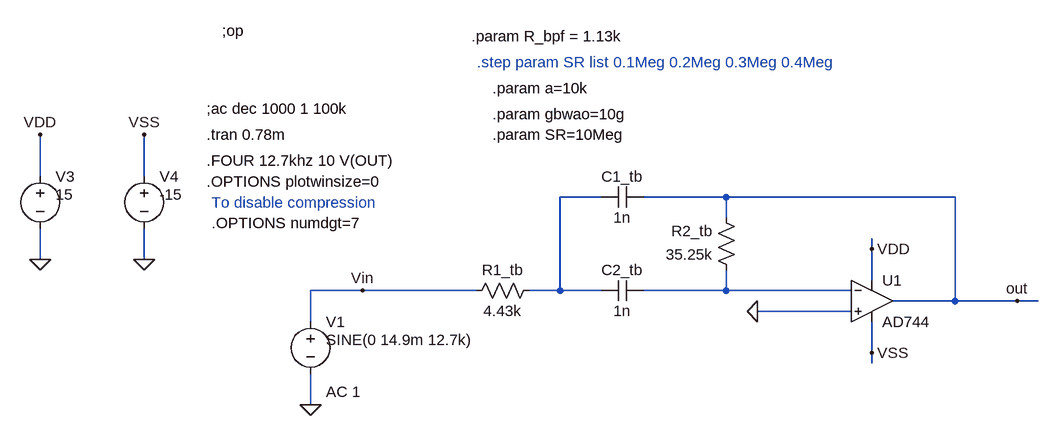
[diagram p0: schematic FTB_Rauch[1].asc]
FTB_Rauch[1].asc, the LTspice schematic file:
Version 4
SHEET 1 2932 1708
WIRE 1088 -16 1088 -80
WIRE 1248 -16 1248 -80
WIRE 1952 16 1888 16
WIRE 2144 16 2016 16
WIRE 2496 16 2144 16
WIRE 2144 48 2144 16
WIRE 2368 96 2368 80
WIRE 1088 112 1088 64
WIRE 1248 112 1248 64
WIRE 2368 144 2368 96
WIRE 1584 160 1504 160
WIRE 1760 160 1584 160
WIRE 1888 160 1888 16
WIRE 1888 160 1840 160
WIRE 1952 160 1888 160
WIRE 2144 160 2144 128
WIRE 2144 160 2016 160
WIRE 2336 160 2144 160
WIRE 2496 176 2496 16
WIRE 2496 176 2400 176
WIRE 2592 176 2496 176
WIRE 2624 176 2592 176
WIRE 2336 192 2192 192
WIRE 1504 208 1504 160
WIRE 2368 256 2368 208
WIRE 2368 272 2368 256
WIRE 1504 336 1504 288
FLAG 1088 112 0
FLAG 1248 112 0
FLAG 1088 -80 VDD
FLAG 1248 -80 VSS
FLAG 1504 336 0
FLAG 2592 176 out
FLAG 2368 256 VSS
FLAG 2368 96 VDD
FLAG 1584 160 Vin
FLAG 2192 192 0
DATAFLAG 1664 160 ""
DATAFLAG 1920 160 ""
DATAFLAG 2192 160 ""
DATAFLAG 2272 192 ""
DATAFLAG 2464 176 ""
SYMBOL voltage 1088 -32 R0
WINDOW 123 24 124 Left 2
WINDOW 39 0 0 Left 2
WINDOW 3 24 44 Left 2
SYMATTR Value 15
SYMATTR InstName V3
SYMBOL voltage 1248 -32 R0
WINDOW 123 24 124 Left 2
WINDOW 39 0 0 Left 2
WINDOW 3 24 44 Left 2
SYMATTR Value -15
SYMATTR InstName V4
SYMBOL voltage 1504 192 R0
WINDOW 123 24 124 Left 2
WINDOW 39 0 0 Left 2
WINDOW 3 24 44 Left 2
SYMATTR Value2 AC 1
SYMATTR Value SINE(0 14.9m 12.7k)
SYMATTR InstName V1
SYMBOL cap 2016 32 M270
WINDOW 0 32 32 VTop 2
WINDOW 3 0 32 VBottom 2
SYMATTR InstName C1_tb
SYMATTR Value 1n
SYMBOL res 1856 144 R90
WINDOW 0 0 56 VBottom 2
WINDOW 3 32 56 VTop 2
SYMATTR InstName R1_tb
SYMATTR Value 4.43k
SYMBOL res 2160 144 R180
WINDOW 0 36 76 Left 2
WINDOW 3 36 40 Left 2
SYMATTR InstName R2_tb
SYMATTR Value 35.25k
SYMBOL cap 1952 176 R270
WINDOW 0 32 32 VTop 2
WINDOW 3 0 32 VBottom 2
SYMATTR InstName C2_tb
SYMATTR Value 1n
SYMBOL OpAmps\\AD744 2368 112 R0
SYMATTR InstName U1
TEXT 1344 -120 Left 2 !;ac dec 1000 1 100k
TEXT 1344 -80 Left 2 !.tran 0.78m
TEXT 1784 -152 Left 2 !.param a=10k
TEXT 1784 -112 Left 2 !.param gbwao=10g
TEXT 1784 -80 Left 2 !.param SR=10Meg
TEXT 1344 -40 Left 2 !.FOUR 12.7khz 10 V(OUT)
TEXT 1344 -8 Left 2 !.OPTIONS plotwinsize=0
TEXT 1352 24 Left 2 ;To disable compression
TEXT 1352 56 Left 2 !.OPTIONS numdgt=7
TEXT 1760 -192 Left 2 ;.step param SR list 0.1Meg 0.2Meg 0.3Meg 0.4Meg
TEXT 1752 -232 Left 2 !.param R_bpf = 1.13k
TEXT 1368 -240 Left 2 !;op

The netlist it stands for:
* FTB_Rauch[1].asc
V3 VDD 0 15
V4 VSS 0 -15
V1 Vin 0 SINE(0 14.9m 12.7k) AC 1
C1_tb out N001 1n
R1_tb N001 Vin 4.43k
R2_tb N002 out 35.25k
C2_tb N001 N002 1n
XU1 0 N002 VDD VSS out AD744  ; pins In+ In- V+ V- OUT
;ac dec 1000 1 100k
.tran 0.78m
.param a=10k
.param gbwao=10g
.param SR=10Meg
.FOUR 12.7khz 10 V(OUT)
.OPTIONS plotwinsize=0
* To disable compression
.OPTIONS numdgt=7
* .step param SR list 0.1Meg 0.2Meg 0.3Meg 0.4Meg
.param R_bpf = 1.13k
;op
.backanno
.end

* Results of the author's LTspice run, read from the files saved beside the schematic
* Operating Point, zero values left out:
*   V(vdd) = 15 V
*   V(vss) = -15 V
*   V(out) = 3.877 µV
*   I(R2_tb) = -110 pA
*   I(V4) = 4.899 mA
*   I(V3) = -4.899 mA
*   Ix(u1:1) = 110 pA
*   Ix(u1:2) = 110 pA
*   Ix(u1:3) = 4.899 mA
*   Ix(u1:4) = -4.899 mA
*   Ix(u1:5) = -110 pA
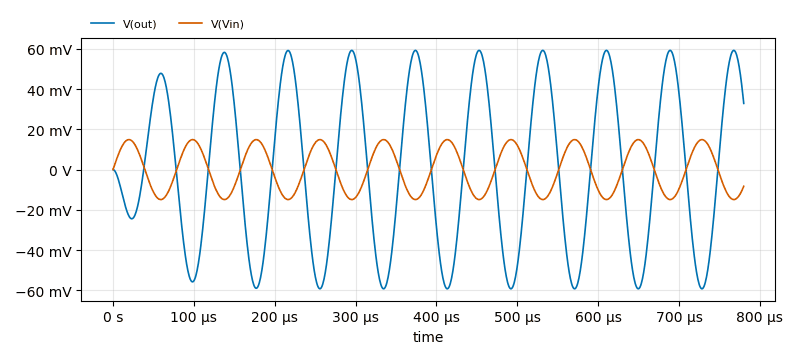
[diagram p1: Transient Analysis of FTB_Rauch[1].asc, plotted from the saved traces]
* Transient Analysis, 1 run:
*   V(out): min -59.23 mV, max 59.24 mV, average 795.7 µV, rms 40.59 mV, last 32.88 mV
*   V(Vin): min -14.9 mV, max 14.9 mV, average 40.54 µV, rms 10.57 mV, last -8.297 mV
* From the log:
*   N-Period=1
*   Fourier components of V(out)
*   DC component:4.09217e-006
*   Harmonic  Frequency   Fourier   Normalized   Phase    Normalized
*    Number     [Hz]     Component   Component  [degree]  Phase [deg]
*       1     1.270e+04  5.922e-02  1.000e+00   -179.84°      0.00°
*       2     2.540e+04  4.291e-07  7.247e-06    160.65°    340.49°
*       3     3.810e+04  4.288e-07  7.241e-06   -164.02°     15.82°
*       4     5.080e+04  4.283e-07  7.233e-06   -128.70°     51.14°
*       5     6.350e+04  4.277e-07  7.223e-06    -93.38°     86.46°
*       6     7.620e+04  4.270e-07  7.210e-06    -58.07°    121.77°
*       7     8.890e+04  4.261e-07  7.195e-06    -22.76°    157.08°
*       8     1.016e+05  4.251e-07  7.178e-06     12.54°    192.39°
*       9     1.143e+05  4.239e-07  7.159e-06     47.84°    227.68°
*      10     1.270e+05  4.226e-07  7.137e-06     83.13°    262.97°
*   Total Harmonic Distortion: 0.002161%(0.014759%)